# EAGLE design regC_to_HL (EAGLE 9.6.1)
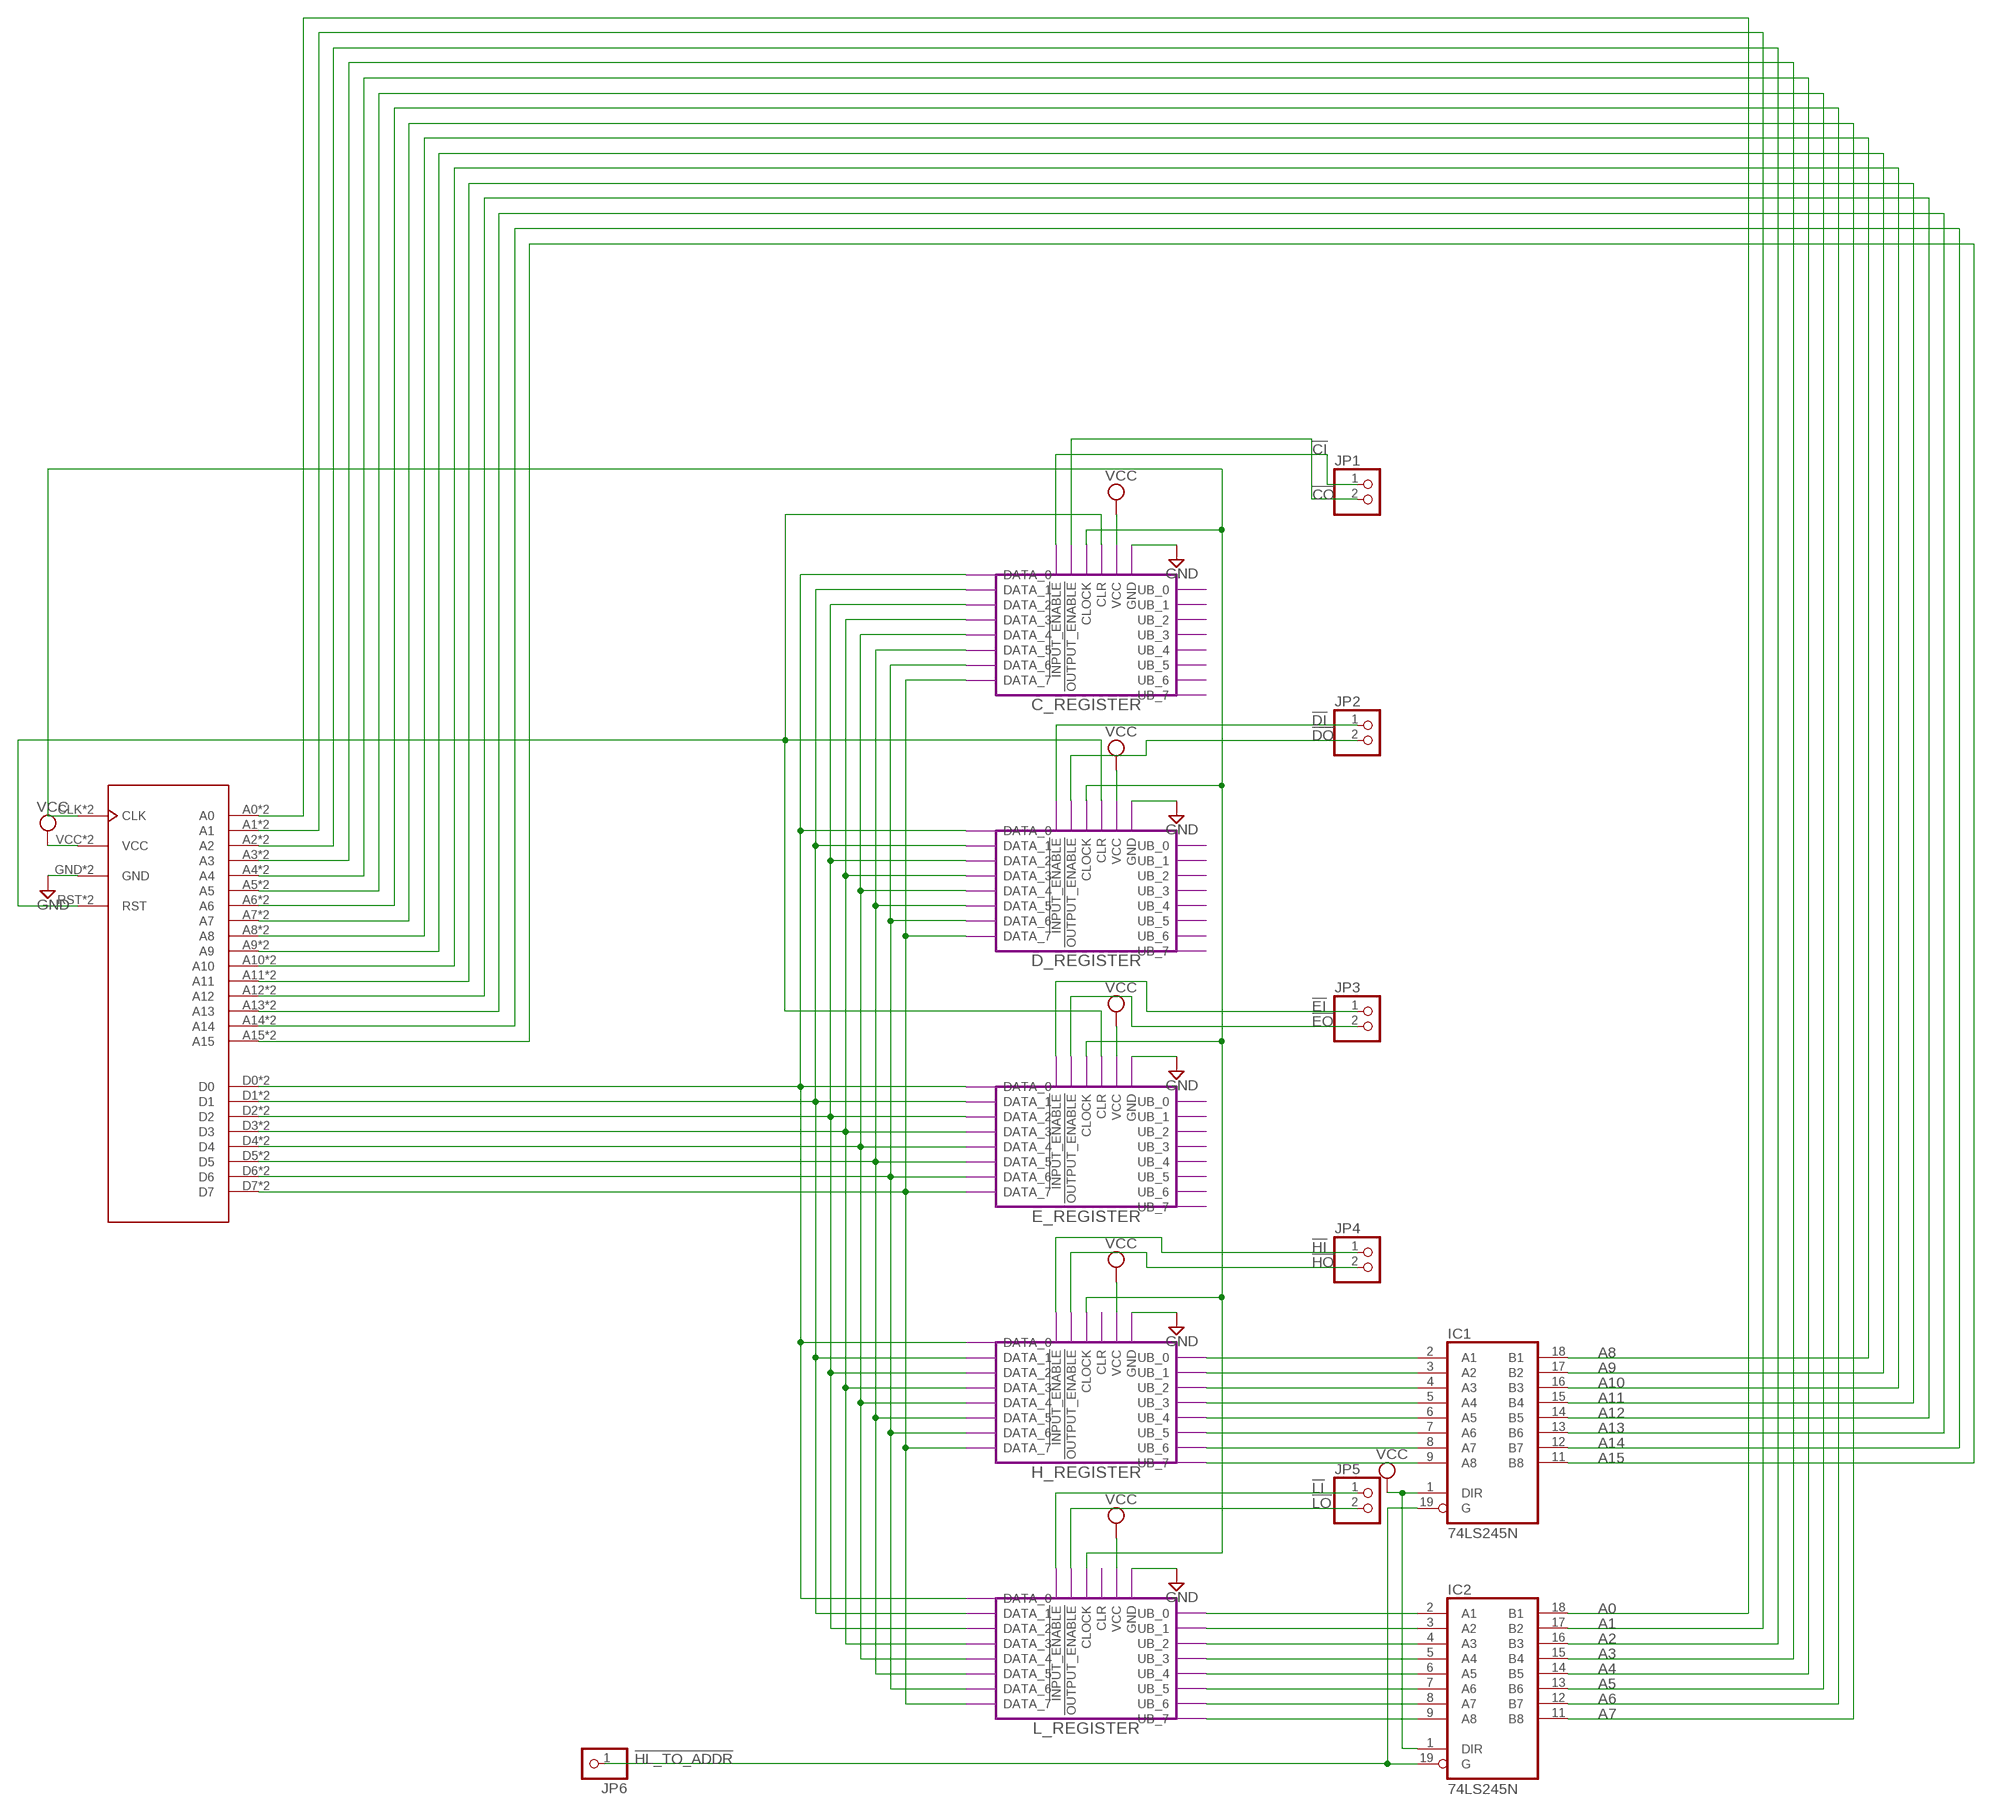
[diagram p0: schematic, sheet 1]

## Parts
IC1  74LS245N  [DIL20]
IC2  74LS245N  [DIL20]
JP1  PINHD-1X2/90  [1X02/90]
JP2  PINHD-1X2/90  [1X02/90]
JP3  PINHD-1X2/90  [1X02/90]
JP4  PINHD-1X2/90  [1X02/90]
JP5  PINHD-1X2/90  [1X02/90]
JP6  PINHD-1X1  [1X01]
U$1  PORT_BOARD  [PORT_FOOTPT]

## Module instances
C_REGISTER = DATA_REGISTOR
D_REGISTER = DATA_REGISTOR
E_REGISTER = DATA_REGISTOR
H_REGISTER = DATA_REGISTOR$A
L_REGISTER = DATA_REGISTOR$A

## Nets
!CI: JP1.1 ; port C_REGISTER.!INPUT_ENABLE
!CO: JP1.2 ; port C_REGISTER.!OUTPUT_ENABLE
!DI: JP2.1 ; port D_REGISTER.!INPUT_ENABLE
!DO: JP2.2 ; port D_REGISTER.!OUTPUT_ENABLE
!EI: JP3.1 ; port E_REGISTER.!INPUT_ENABLE
!EO: JP3.2 ; port E_REGISTER.!OUTPUT_ENABLE
!HI: JP4.1 ; port H_REGISTER.!INPUT_ENABLE
!HL_TO_ADDR: IC1.19(G) IC2.19(G) JP6.1
!HO: JP4.2 ; port H_REGISTER.!OUTPUT_ENABLE
!LI: JP5.1 ; port L_REGISTER.!INPUT_ENABLE
!LO: JP5.2 ; port L_REGISTER.!OUTPUT_ENABLE
A0: IC2.18(B1) U$1.A0 U$1.A16(A0)
A1: IC2.17(B2) U$1.A1 U$1.A17(A1)
A2: IC2.16(B3) U$1.A2 U$1.A18(A2)
A3: IC2.15(B4) U$1.A3 U$1.A19(A3)
A4: IC2.14(B5) U$1.A4 U$1.A20(A4)
A5: IC2.13(B6) U$1.A5 U$1.A21(A5)
A6: IC2.12(B7) U$1.A6 U$1.A22(A6)
A7: IC2.11(B8) U$1.A7 U$1.A23(A7)
A8: IC1.18(B1) U$1.A8 U$1.A24(A8)
A9: IC1.17(B2) U$1.A9 U$1.A25(A9)
A10: IC1.16(B3) U$1.A10 U$1.A26(A10)
A11: IC1.15(B4) U$1.A11 U$1.A27(A11)
A12: IC1.14(B5) U$1.A12 U$1.A28(A12)
A13: IC1.13(B6) U$1.A13 U$1.A29(A13)
A14: IC1.12(B7) U$1.A14 U$1.A30(A14)
A15: IC1.11(B8) U$1.A15 U$1.A31(A15)
CLOCK1: U$1.CLK U$1.CLK1(CLK) ; port L_REGISTER.CLOCK H_REGISTER.CLOCK E_REGISTER.CLOCK D_REGISTER.CLOCK C_REGISTER.CLOCK
DATA_0: U$1.D0 U$1.D8(D0) ; port C_REGISTER.DATA_0 D_REGISTER.DATA_0 E_REGISTER.DATA_0 H_REGISTER.DATA_0 L_REGISTER.DATA_0
DATA_1: U$1.D1 U$1.D9(D1) ; port C_REGISTER.DATA_1 D_REGISTER.DATA_1 E_REGISTER.DATA_1 H_REGISTER.DATA_1 L_REGISTER.DATA_1
DATA_2: U$1.D2 U$1.D10(D2) ; port C_REGISTER.DATA_2 D_REGISTER.DATA_2 E_REGISTER.DATA_2 H_REGISTER.DATA_2 L_REGISTER.DATA_2
DATA_3: U$1.D3 U$1.D11(D3) ; port C_REGISTER.DATA_3 D_REGISTER.DATA_3 E_REGISTER.DATA_3 H_REGISTER.DATA_3 L_REGISTER.DATA_3
DATA_4: U$1.D4 U$1.D12(D4) ; port C_REGISTER.DATA_4 D_REGISTER.DATA_4 E_REGISTER.DATA_4 H_REGISTER.DATA_4 L_REGISTER.DATA_4
DATA_5: U$1.D5 U$1.D13(D5) ; port C_REGISTER.DATA_5 D_REGISTER.DATA_5 E_REGISTER.DATA_5 H_REGISTER.DATA_5 L_REGISTER.DATA_5
DATA_6: U$1.D6 U$1.D14(D6) ; port C_REGISTER.DATA_6 D_REGISTER.DATA_6 E_REGISTER.DATA_6 H_REGISTER.DATA_6 L_REGISTER.DATA_6
DATA_7: U$1.D7 U$1.D15(D7) ; port C_REGISTER.DATA_7 D_REGISTER.DATA_7 E_REGISTER.DATA_7 H_REGISTER.DATA_7 L_REGISTER.DATA_7
GND: U$1.GND U$1.GND1(GND) ; port C_REGISTER.GND D_REGISTER.GND E_REGISTER.GND H_REGISTER.GND L_REGISTER.GND
N$1: U$1.RST U$1.RST1(RST) ; port E_REGISTER.CLR D_REGISTER.CLR C_REGISTER.CLR
N$18: IC1.2(A1) ; port H_REGISTER.UB_0
N$19: IC1.3(A2) ; port H_REGISTER.UB_1
N$20: IC1.4(A3) ; port H_REGISTER.UB_2
N$21: IC1.5(A4) ; port H_REGISTER.UB_3
N$22: IC1.6(A5) ; port H_REGISTER.UB_4
N$23: IC1.7(A6) ; port H_REGISTER.UB_5
N$24: IC1.8(A7) ; port H_REGISTER.UB_6
N$25: IC1.9(A8) ; port H_REGISTER.UB_7
N$26: IC2.2(A1) ; port L_REGISTER.UB_0
N$27: IC2.3(A2) ; port L_REGISTER.UB_1
N$28: IC2.4(A3) ; port L_REGISTER.UB_2
N$29: IC2.5(A4) ; port L_REGISTER.UB_3
N$30: IC2.6(A5) ; port L_REGISTER.UB_4
N$31: IC2.7(A6) ; port L_REGISTER.UB_5
N$32: IC2.8(A7) ; port L_REGISTER.UB_6
N$33: IC2.9(A8) ; port L_REGISTER.UB_7
VCC: IC1.1(DIR) IC2.1(DIR) U$1.VCC U$1.VCC1(VCC) ; port C_REGISTER.VCC D_REGISTER.VCC E_REGISTER.VCC H_REGISTER.VCC L_REGISTER.VCC

## Power pins joined to a net without a drawn wire
GND: IC1.10(GND) IC2.10(GND)
VCC: IC1.20(VCC) IC2.20(VCC)

## Library data of the parts
IC1 IC2 = 74xx-eu:74*245: Octal BUS TRANSCEIVER, 3-state
JP1-JP5 = pinhead:PINHD-1X2: PIN HEADER
JP6 = pinhead:PINHD-1X1: PIN HEADER
U$1 = stack_interface:PORT_BOARD

## Module DATA_REGISTOR
Ports: DATA_0(io) DATA_1(io) DATA_2(io) DATA_3(io) DATA_4(io) DATA_5(io) DATA_6(io) DATA_7(io) !INPUT_ENABLE(in) !OUTPUT_ENABLE(in) CLOCK(in) CLR(in) UB_0(out) UB_1(out) UB_2(out) UB_3(out) UB_4(out) UB_5(out) UB_6(out) UB_7(out) VCC(pwr) GND(pwr)
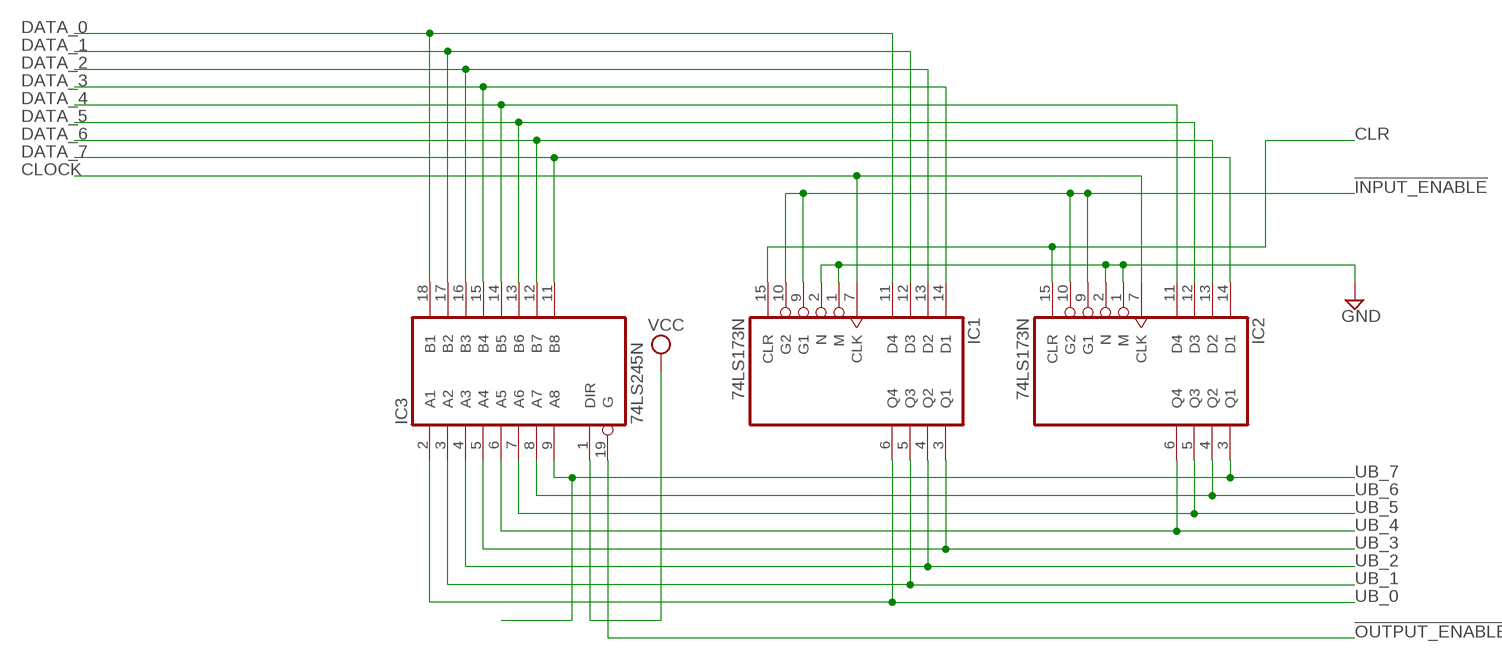
[diagram p1: schematic, module DATA_REGISTOR, sheet 1]

### Parts
IC1  74LS173N  [DIL16]
IC2  74LS173N  [DIL16]
IC3  74LS245N  [DIL20]

### Nets
!INPUT_ENABLE: IC1.9(G1) IC1.10(G2) IC2.9(G1) IC2.10(G2)
!OUTPUT_ENABLE: IC3.19(G)
CLOCK: IC1.7(CLK) IC2.7(CLK)
CLR: IC1.15(CLR) IC2.15(CLR)
DATA_0: IC1.11(D4) IC3.18(B1)
DATA_1: IC1.12(D3) IC3.17(B2)
DATA_2: IC1.13(D2) IC3.16(B3)
DATA_3: IC1.14(D1) IC3.15(B4)
DATA_4: IC2.11(D4) IC3.14(B5)
DATA_5: IC2.12(D3) IC3.13(B6)
DATA_6: IC2.13(D2) IC3.12(B7)
DATA_7: IC2.14(D1) IC3.11(B8)
GND: IC1.1(M) IC1.2(N) IC2.1(M) IC2.2(N)
UB_0: IC1.6(Q4) IC3.2(A1)
UB_1: IC1.5(Q3) IC3.3(A2)
UB_2: IC1.4(Q2) IC3.4(A3)
UB_3: IC1.3(Q1) IC3.5(A4)
UB_4: IC2.6(Q4) IC3.6(A5)
UB_5: IC2.5(Q3) IC3.7(A6)
UB_6: IC2.4(Q2) IC3.8(A7)
UB_7: IC2.3(Q1) IC3.9(A8)
VCC: IC3.1(DIR)

### Power pins joined to a net without a drawn wire
GND: IC1.8(GND) IC2.8(GND) IC3.10(GND)
VCC: IC1.16(VCC) IC2.16(VCC) IC3.20(VCC)

### Library data of the parts
IC1 IC2 = 74xx-eu:74*173: 4-bit D type REGISTER, 3-state
IC3 = 74xx-eu:74*245: Octal BUS TRANSCEIVER, 3-state

## Module DATA_REGISTOR$A
Ports: DATA_0(io) DATA_1(io) DATA_2(io) DATA_3(io) DATA_4(io) DATA_5(io) DATA_6(io) DATA_7(io) !INPUT_ENABLE(in) !OUTPUT_ENABLE(in) CLOCK(in) CLR(in) UB_0(out) UB_1(out) UB_2(out) UB_3(out) UB_4(out) UB_5(out) UB_6(out) UB_7(out) VCC(pwr) GND(pwr)
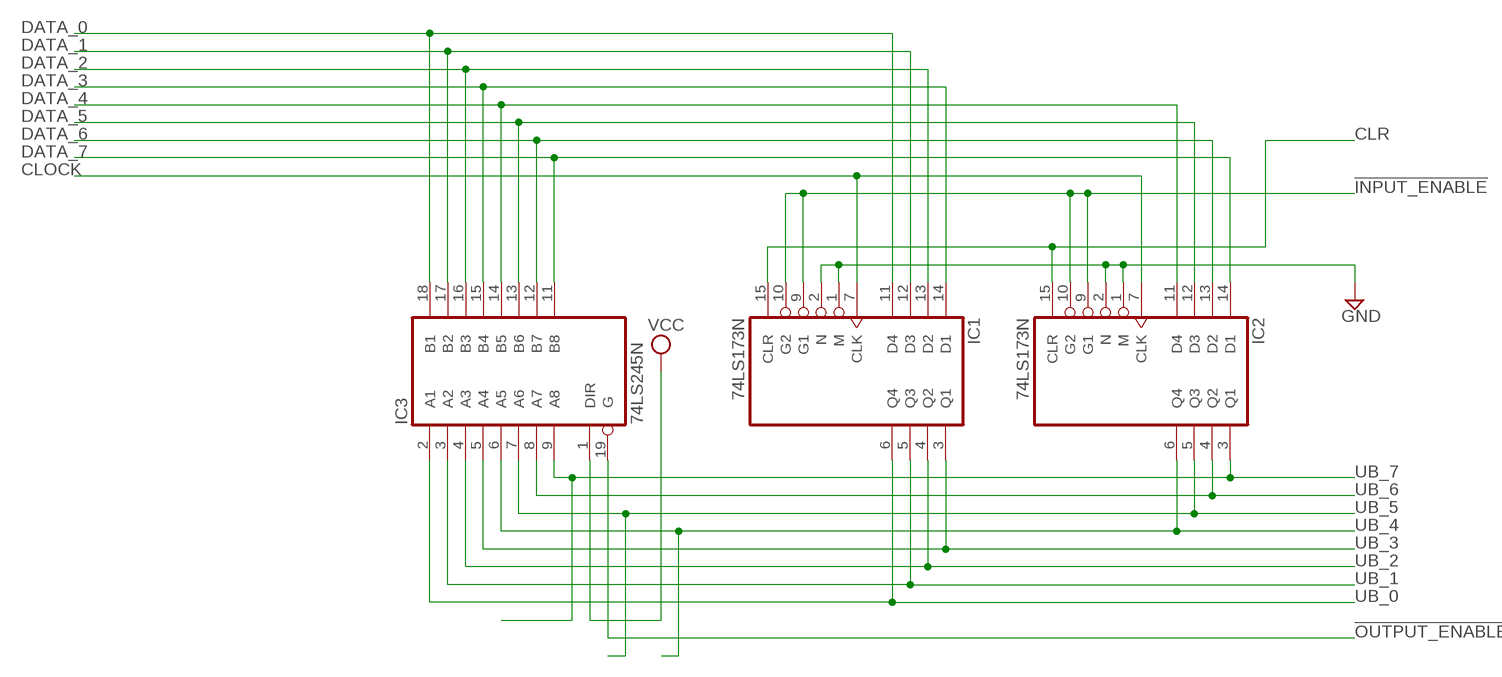
[diagram p2: schematic, module DATA_REGISTOR$A, sheet 1]

### Parts
IC1  74LS173N  [DIL16]
IC2  74LS173N  [DIL16]
IC3  74LS245N  [DIL20]

### Nets
!INPUT_ENABLE: IC1.9(G1) IC1.10(G2) IC2.9(G1) IC2.10(G2)
!OUTPUT_ENABLE: IC3.19(G)
CLOCK: IC1.7(CLK) IC2.7(CLK)
CLR: IC1.15(CLR) IC2.15(CLR)
DATA_0: IC1.11(D4) IC3.18(B1)
DATA_1: IC1.12(D3) IC3.17(B2)
DATA_2: IC1.13(D2) IC3.16(B3)
DATA_3: IC1.14(D1) IC3.15(B4)
DATA_4: IC2.11(D4) IC3.14(B5)
DATA_5: IC2.12(D3) IC3.13(B6)
DATA_6: IC2.13(D2) IC3.12(B7)
DATA_7: IC2.14(D1) IC3.11(B8)
GND: IC1.1(M) IC1.2(N) IC2.1(M) IC2.2(N)
UB_0: IC1.6(Q4) IC3.2(A1)
UB_1: IC1.5(Q3) IC3.3(A2)
UB_2: IC1.4(Q2) IC3.4(A3)
UB_3: IC1.3(Q1) IC3.5(A4)
UB_4: IC2.6(Q4) IC3.6(A5)
UB_5: IC2.5(Q3) IC3.7(A6)
UB_6: IC2.4(Q2) IC3.8(A7)
UB_7: IC2.3(Q1) IC3.9(A8)
VCC: IC3.1(DIR)

### Power pins joined to a net without a drawn wire
GND: IC1.8(GND) IC2.8(GND) IC3.10(GND)
VCC: IC1.16(VCC) IC2.16(VCC) IC3.20(VCC)

### Library data of the parts
IC1 IC2 = 74xx-eu:74*173: 4-bit D type REGISTER, 3-state
IC3 = 74xx-eu:74*245: Octal BUS TRANSCEIVER, 3-state

## Board
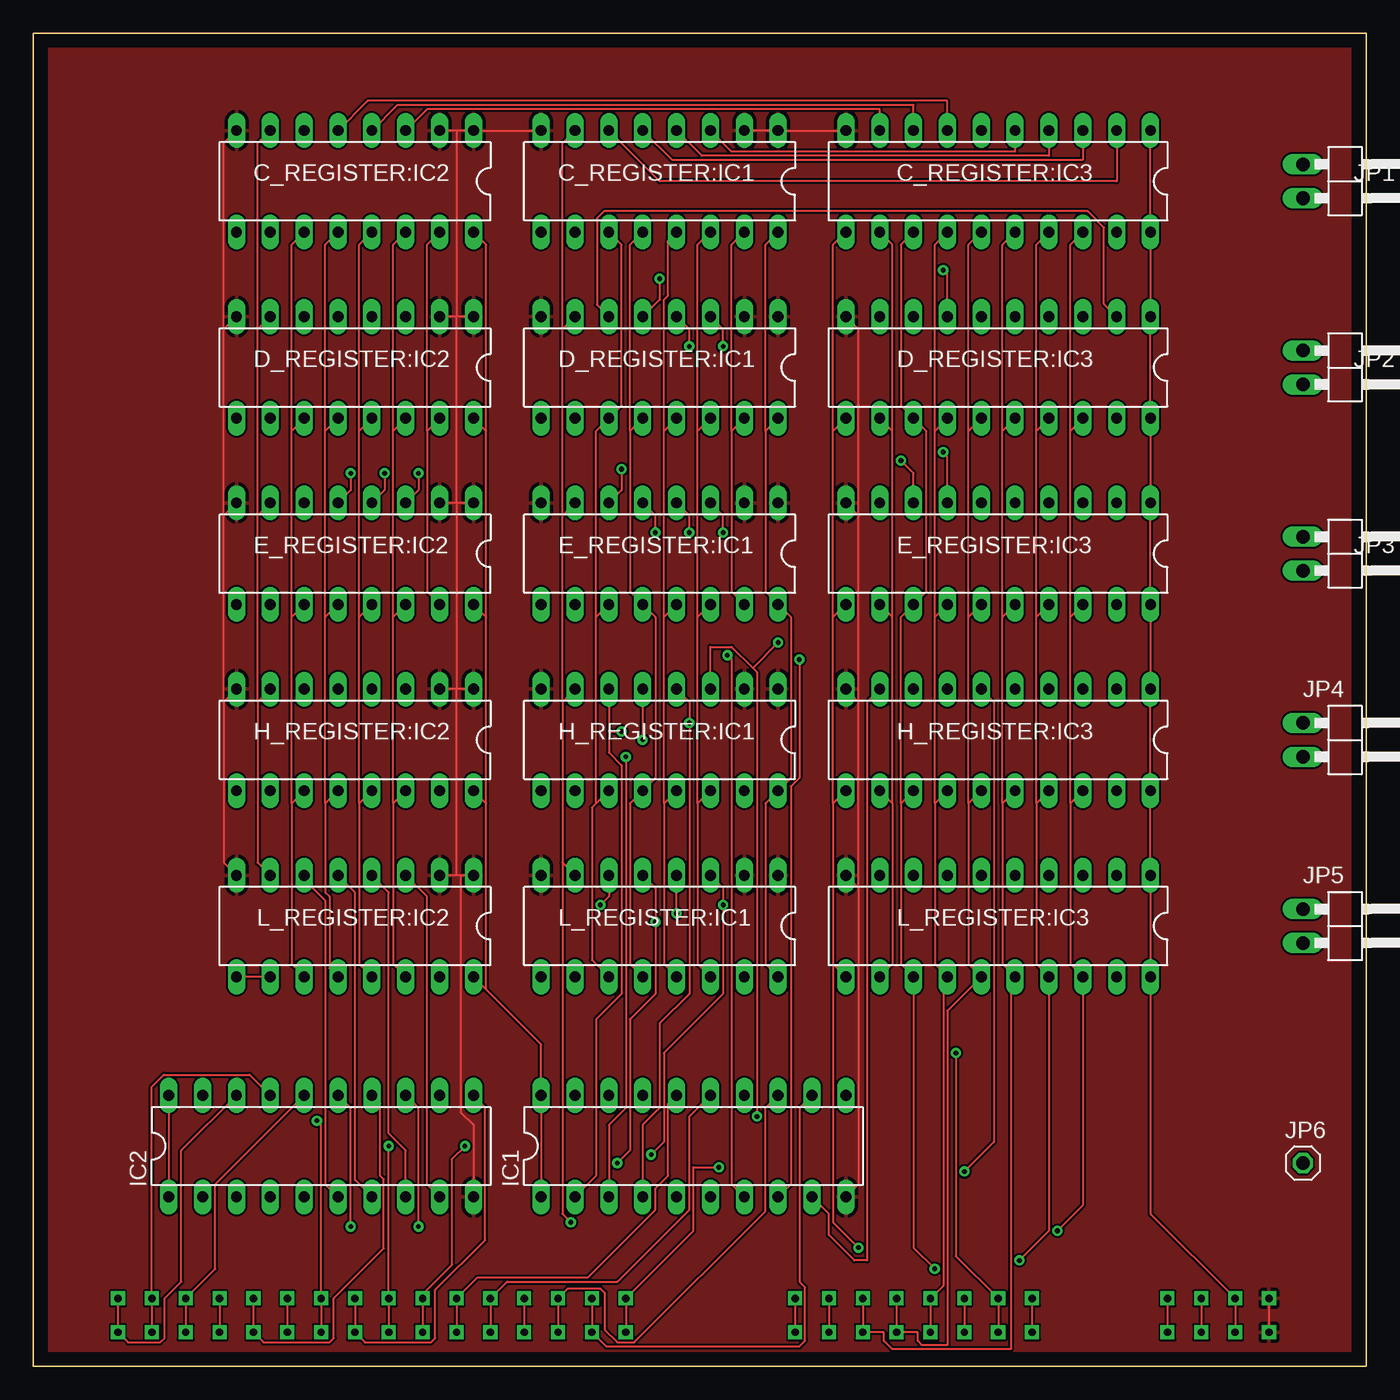
[diagram p3: board, top side]
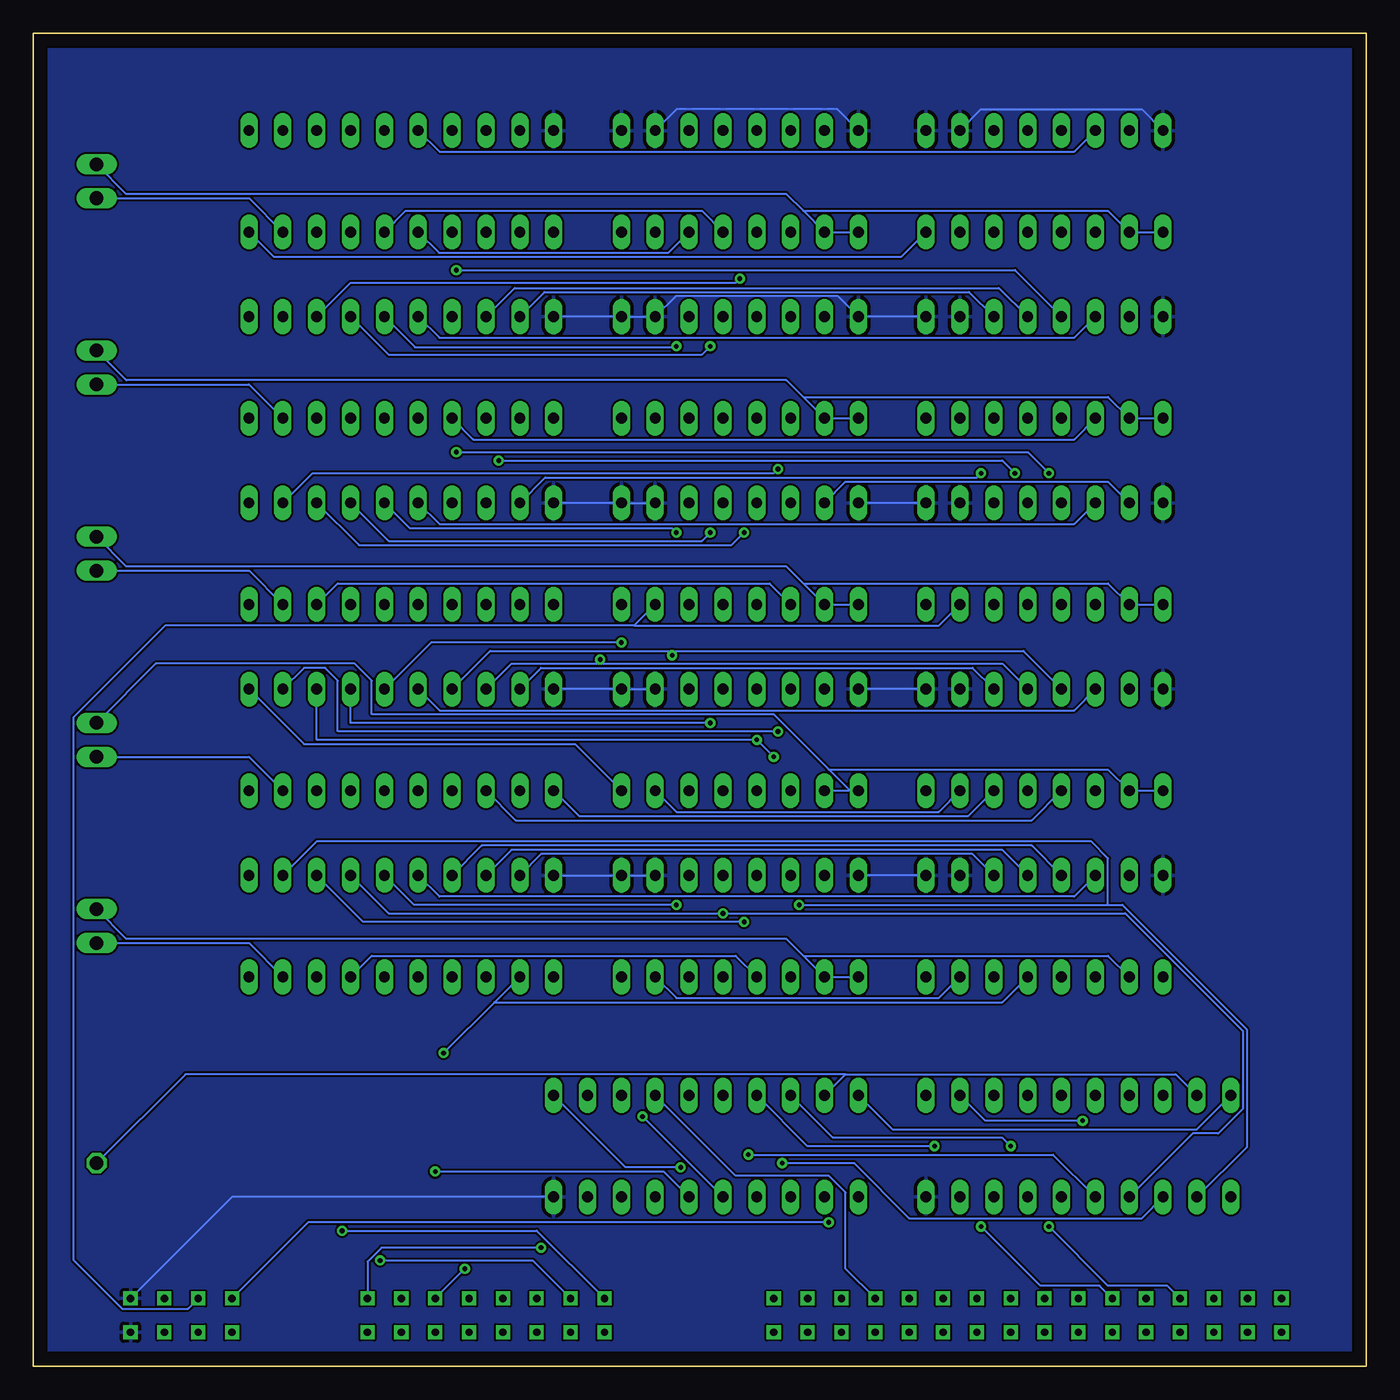
[diagram p4: board, bottom side, seen from below]

Size 100 x 100 mm. Coordinates in mm from the lower left corner, seen from the top.
Copper layers (1*16): Top 0.035mm / dielectric 1.5mm / Bottom 0.035mm
Design rules "default": minimum track width 6mil, minimum drill 0.35mm, track to track 6mil, track to pad 6mil, pad to pad 6mil, via to via 6mil, smd to smd 6mil, copper to edge 40mil, drill to drill 6mil, minimum pad ring 10mil, minimum via ring 8mil, stop-mask expansion 4mil, vias tented up to drill 0mil, thermal gap 10mil

### Footprints (pad centres in the part's own frame; a part is rotated, then mirrored left to right if it is on the bottom)
DIL16 = drill 0.813 long: 1 -8.89,-3.81; 2 -6.35,-3.81; 3 -3.81,-3.81; 4 -1.27,-3.81; 5 1.27,-3.81; 6 3.81,-3.81; 7 6.35,-3.81; 8 8.89,-3.81; 9 8.89,3.81; 10 6.35,3.81; 11 3.81,3.81; 12 1.27,3.81; 13 -1.27,3.81; 14 -3.81,3.81; 15 -6.35,3.81; 16 -8.89,3.81
DIL20 = drill 0.813 long: 1 -11.43,-3.81; 2 -8.89,-3.81; 3 -6.35,-3.81; 4 -3.81,-3.81; 5 -1.27,-3.81; 6 1.27,-3.81; 7 3.81,-3.81; 8 6.35,-3.81; 9 8.89,-3.81; 10 11.43,-3.81; 11 11.43,3.81; 12 8.89,3.81; 13 6.35,3.81; 14 3.81,3.81; 15 1.27,3.81; 16 -1.27,3.81; 17 -3.81,3.81; 18 -6.35,3.81; 19 -8.89,3.81; 20 -11.43,3.81
1X02/90 = drill 1.016 long: 1 -1.27,-3.81; 2 1.27,-3.81
1X01 = drill 1.016 octagon: 1 0,0
PORT_FOOTPT = drill 0.55 square: A0 6.35,2.54; A1 8.89,2.54; A2 11.43,2.54; A3 13.97,2.54; A4 16.51,2.54; A5 19.05,2.54; A6 21.59,2.54; A7 24.13,2.54; A8 26.67,2.54; A9 29.21,2.54; A10 31.75,2.54; A11 34.29,2.54; A12 36.83,2.54; A13 39.37,2.54; A14 41.91,2.54; A15 44.45,2.54; A16 6.35,5.08; A17 8.89,5.08; A18 11.43,5.08; A19 13.97,5.08; A20 16.51,5.08; A21 19.05,5.08; A22 21.59,5.08; A23 24.13,5.08; A24 26.67,5.08; A25 29.21,5.08; A26 31.75,5.08; A27 34.29,5.08; A28 36.83,5.08; A29 39.37,5.08; A30 41.91,5.08; A31 44.45,5.08; CLK 85.09,2.54; CLK1 85.09,5.08; D0 57.15,2.54; D1 59.69,2.54; D2 62.23,2.54; D3 64.77,2.54; D4 67.31,2.54; D5 69.85,2.54; D6 72.39,2.54; D7 74.93,2.54; D8 57.15,5.08; D9 59.69,5.08; D10 62.23,5.08; D11 64.77,5.08; D12 67.31,5.08; D13 69.85,5.08; D14 72.39,5.08; D15 74.93,5.08; GND 92.71,2.54; GND1 92.71,5.08; RST 87.63,2.54; RST1 87.63,5.08; VCC 90.17,2.54; VCC1 90.17,5.08

### Placement (x,y rotation side)
C_REGISTER:IC1  74LS173N  [DIL16]  46.99,88.9 180 top
C_REGISTER:IC2  74LS173N  [DIL16]  24.13,88.9 180 top
C_REGISTER:IC3  74LS245N  [DIL20]  72.39,88.9 180 top
D_REGISTER:IC1  74LS173N  [DIL16]  46.99,74.93 180 top
D_REGISTER:IC2  74LS173N  [DIL16]  24.13,74.93 180 top
D_REGISTER:IC3  74LS245N  [DIL20]  72.39,74.93 180 top
E_REGISTER:IC1  74LS173N  [DIL16]  46.99,60.96 180 top
E_REGISTER:IC2  74LS173N  [DIL16]  24.13,60.96 180 top
E_REGISTER:IC3  74LS245N  [DIL20]  72.39,60.96 180 top
H_REGISTER:IC1  74LS173N  [DIL16]  46.99,46.99 180 top
H_REGISTER:IC2  74LS173N  [DIL16]  24.13,46.99 180 top
H_REGISTER:IC3  74LS245N  [DIL20]  72.39,46.99 180 top
IC1  49.53,16.51 0 top
IC2  21.59,16.51 0 top
JP1  99.06,88.9 270 top
JP2  99.06,74.93 270 top
JP3  99.06,60.96 270 top
JP4  99.06,46.99 270 top
JP5  99.06,33.02 270 top
JP6  95.25,15.24 0 top
L_REGISTER:IC1  74LS173N  [DIL16]  46.99,33.02 180 top
L_REGISTER:IC2  74LS173N  [DIL16]  24.13,33.02 180 top
L_REGISTER:IC3  74LS245N  [DIL20]  72.39,33.02 180 top
U$1  0,0 0 top

### Tracks (layer width: path | path; a pad name or v marks a point on that pad's centre or on a via)
!CI
  Bottom 0.152: C_REGISTER:IC2.9 C_REGISTER:IC2.10 19.37,86.68 42.23,86.68 | C_REGISTER:IC1.9 C_REGISTER:IC1.10 42.23,86.68 | JP1.1 93.03,87.95 43.5,87.95 42.23,86.68
!CO
  Bottom 0.152: C_REGISTER:IC3.19 83.82,87.63 JP1.2
!DI
  Bottom 0.152: D_REGISTER:IC2.9 D_REGISTER:IC2.10 19.37,72.71 42.23,72.71 | D_REGISTER:IC1.9 D_REGISTER:IC1.10 42.23,72.71 | JP2.1 93.03,73.98 43.5,73.98 42.23,72.71
!DO
  Bottom 0.152: D_REGISTER:IC3.19 83.82,73.66 JP2.2
!EI
  Bottom 0.152: E_REGISTER:IC2.9 E_REGISTER:IC2.10 19.37,58.74 42.23,58.74 | E_REGISTER:IC1.9 E_REGISTER:IC1.10 42.23,58.74 | JP3.1 93.03,60.01 43.5,60.01 42.23,58.74
!EO
  Bottom 0.152: E_REGISTER:IC3.19 83.82,59.69 JP3.2
!HI
  Bottom 0.152: H_REGISTER:IC2.9 H_REGISTER:IC2.10 19.37,44.77 40.32,44.77 | H_REGISTER:IC1.10 38.73,43.18 | JP4.1 90.81,52.7 75.88,52.7 74.61,51.43 74.61,48.89 44.45,48.89 40.32,44.77 | 38.73,43.18 40.32,44.77 | 38.73,43.18 H_REGISTER:IC1.9
!HL_TO_ADDR
  Bottom 0.152: IC2.19 14.29,21.91 39.05,21.91 | IC1.19 39.05,21.91 | JP6.1 88.58,21.91 39.05,21.91
!HO
  Bottom 0.152: H_REGISTER:IC3.19 83.82,45.72 JP4.2
!LI
  Top 0.152: L_REGISTER:IC2.10 L_REGISTER:IC2.9
  Bottom 0.152: L_REGISTER:IC1.9 L_REGISTER:IC1.10 42.23,30.8 | JP5.1 93.03,32.07 43.5,32.07 42.23,30.8 | L_REGISTER:IC2.10 19.37,30.8 42.23,30.8
!LO
  Bottom 0.152: L_REGISTER:IC3.19 83.82,31.75 JP5.2
A0
  Top 0.152: U$1.A16 U$1.A0 7.11,1.78 9.51,1.78 9.84,2.11 9.84,5.08 11.11,6.35 11.11,16.19 IC2.18
A1
  Top 0.152: U$1.A1 U$1.A17 8.89,20.97 9.79,21.87 16.23,21.87 IC2.17
A2
  Top 0.152: U$1.A2 U$1.A18 13.65,7.3 13.65,13.65 IC2.16
A3  (via drill 0.35)
  Top 0.152: U$1.A19 U$1.A3 | IC2.15 23.81,19.37 v23.81,10.48
  Bottom 0.152: v23.81,10.48 19.37,6.03 14.92,6.03 U$1.A19
A4
  Top 0.152: U$1.A20 U$1.A4 17.27,1.78 22.21,1.78 22.54,2.11 22.54,5.08 26.29,8.83 26.29,14.03 26.03,14.29 26.03,19.68 IC2.14
A5  (via drill 0.35)
  Top 0.152: U$1.A21 U$1.A5 | IC2.13 28.89,19.37 v28.89,10.48
  Bottom 0.152: v28.89,10.48 24.45,6.03 20,6.03 U$1.A21
A6  (via drill 0.35)
  Top 0.152: U$1.A6 U$1.A22 21.59,18.1 v21.27,18.41
  Bottom 0.152: IC2.12 28.58,18.41 v21.27,18.41
A7
  Top 0.152: U$1.A23 U$1.A7 24.89,1.78 29.83,1.78 30.16,2.11 30.16,5.71 33.91,9.46 33.91,19.43 IC2.11
A8  (via drill 0.35)
  Top 0.152: U$1.A8 U$1.A24 v26.67,16.51
  Bottom 0.152: IC1.18 40,17.14 27.31,17.14 v26.67,16.51
A9  (via drill 0.35)
  Top 0.152: U$1.A9 U$1.A25 29.21,5.4 31.43,7.62 31.43,15.56 v32.39,16.51
  Bottom 0.152: IC1.17 41.91,16.51 v32.39,16.51
A10
  Top 0.152: U$1.A10 U$1.A26 33.34,6.67 41.61,6.67 46.67,11.74 46.67,13.34 47.62,14.29 47.62,19.68 IC1.16
A11
  Top 0.152: U$1.A11 U$1.A27 35.56,6.35 43.83,6.35 49.21,11.74 49.21,18.73 IC1.15
A12
  Top 0.152: U$1.A28 U$1.A12
  Bottom 0.152: IC1.14 47.31,14.29 40.31,14.29 39.05,13.03 39.05,7.3 U$1.A28
A13
  Top 0.152: U$1.A13 U$1.A29 40.13,5.84 42.53,5.84 42.86,5.51 42.86,2.75 43.83,1.78 45.07,1.78 54.93,11.64 54.93,19.37 IC1.13
A14
  Top 0.152: U$1.A30 U$1.A14 42.97,1.48 57.47,1.48 57.91,1.92 57.91,5.91 57.53,6.29 57.53,19.43 IC1.12
A15  (via drill 0.35)
  Top 0.152: U$1.A15 U$1.A31 49.53,10.16 49.53,14.92 v51.44,14.92
  Bottom 0.152: IC1.11 55.56,14.92 v51.44,14.92
C_REGISTER:UB_0
  Top 0.152: C_REGISTER:IC1.6 46.99,88.9 81.28,88.9 C_REGISTER:IC3.2
C_REGISTER:UB_1
  Top 0.152: C_REGISTER:IC1.5 47.94,90.49 78.74,90.49 C_REGISTER:IC3.3
C_REGISTER:UB_2
  Top 0.152: C_REGISTER:IC1.4 50.16,90.81 76.2,90.81 C_REGISTER:IC3.4
C_REGISTER:UB_3
  Top 0.152: C_REGISTER:IC1.3 52.39,91.12 73.66,91.12 C_REGISTER:IC3.5
C_REGISTER:UB_4
  Bottom 0.152: C_REGISTER:IC2.6 21.91,91.12 69.53,91.12 C_REGISTER:IC3.6
C_REGISTER:UB_5
  Top 0.152: C_REGISTER:IC2.5 25.08,94.93 68.58,94.93 C_REGISTER:IC3.7
C_REGISTER:UB_6
  Top 0.152: C_REGISTER:IC2.4 27.31,94.62 66.04,94.62 C_REGISTER:IC3.8
C_REGISTER:UB_7
  Top 0.152: C_REGISTER:IC2.3 29.53,94.3 63.5,94.3 C_REGISTER:IC3.9
CLOCK1  (via drill 0.35)
  Top 0.152: L_REGISTER:IC2.7 16.83,37.78 16.83,49.85 | H_REGISTER:IC2.7 16.83,49.85 | 16.83,63.82 E_REGISTER:IC2.7 | 16.83,49.85 16.83,63.82 | 16.83,77.79 D_REGISTER:IC2.7 | 16.83,63.82 16.83,77.79 | C_REGISTER:IC2.7 16.83,91.76 16.83,77.79 | U$1.CLK1 U$1.CLK | 39.69,37.78 L_REGISTER:IC1.7 | 39.69,49.85 39.69,37.78 | H_REGISTER:IC1.7 39.69,49.85 | 39.69,63.82 E_REGISTER:IC1.7 | 39.69,49.85 39.69,63.82 | 39.69,77.79 D_REGISTER:IC1.7 | 39.69,63.82 39.69,77.79 | C_REGISTER:IC1.7 39.69,91.76 39.69,77.79 | v40.32,10.79 39.69,11.43 39.69,37.78
  Bottom 0.152: U$1.CLK1 79.38,10.79 v40.32,10.79 | E_REGISTER:IC2.7 19.37,66.36 39.05,66.36 E_REGISTER:IC1.7
D_REGISTER:UB_0
  Top 0.152: D_REGISTER:IC3.2 80.33,79.69 80.33,85.42 79.11,86.64 42.81,86.64 42.29,86.12 42.29,79.63 D_REGISTER:IC1.6
D_REGISTER:UB_1  (via drill 0.35)
  Top 0.152: D_REGISTER:IC1.5 46.99,80.01 v46.99,81.6
  Bottom 0.152: v46.99,81.6 47.31,81.28 76.2,81.28 D_REGISTER:IC3.3
D_REGISTER:UB_2  (via drill 0.35)
  Top 0.152: D_REGISTER:IC1.4 49.21,77.79 v49.21,76.52
  Bottom 0.152: v49.21,76.52 49.85,75.88 73.34,75.88 D_REGISTER:IC3.4
D_REGISTER:UB_3  (via drill 0.35)
  Top 0.152: D_REGISTER:IC1.3 51.75,77.79 v51.75,76.52
  Bottom 0.152: v51.75,76.52 51.82,76.45 71.37,76.45 D_REGISTER:IC3.5
D_REGISTER:UB_4
  Bottom 0.152: D_REGISTER:IC2.6 21.91,77.15 69.53,77.15 D_REGISTER:IC3.6
D_REGISTER:UB_5  (via drill 0.35)
  Top 0.152: v68.26,82.23 68.58,81.92 D_REGISTER:IC3.7
  Bottom 0.152: D_REGISTER:IC2.5 26.35,82.23 v68.26,82.23
D_REGISTER:UB_6
  Bottom 0.152: D_REGISTER:IC3.8 63.88,80.9 27.56,80.9 D_REGISTER:IC2.4
D_REGISTER:UB_7
  Bottom 0.152: D_REGISTER:IC3.9 61.65,80.59 29.79,80.59 D_REGISTER:IC2.3
DATA_0  (via drill 0.35)
  Top 0.152: L_REGISTER:IC1.11 41.91,30.48 41.91,41.91 42.23,42.23 | H_REGISTER:IC1.11 42.23,42.23 | 42.23,56.2 E_REGISTER:IC1.11 | 42.23,42.23 42.23,56.2 | 42.23,56.2 42.23,70.17 D_REGISTER:IC1.11 44.13,72.07 44.13,84.14 C_REGISTER:IC1.11 | U$1.D8 U$1.D0 | 77.79,42.23 77.79,30.16 L_REGISTER:IC3.18 78.74,12.07 v76.84,10.16 | H_REGISTER:IC3.18 77.79,42.23 | 77.79,56.2 E_REGISTER:IC3.18 | 77.79,42.23 77.79,56.2 | 77.79,70.17 D_REGISTER:IC3.18 | 77.79,56.2 77.79,70.17 | C_REGISTER:IC3.18 77.79,84.14 77.79,70.17
  Bottom 0.152: U$1.D8 62.23,10.16 v76.84,10.16 | E_REGISTER:IC1.11 44.77,58.74 77.15,58.74 E_REGISTER:IC3.18
DATA_1  (via drill 0.35)
  Top 0.152: L_REGISTER:IC1.12 44.77,30.16 44.77,42.23 H_REGISTER:IC1.12 46.67,44.13 46.67,56.2 E_REGISTER:IC1.12 44.77,58.1 44.77,70.17 | D_REGISTER:IC1.12 44.77,70.17 | C_REGISTER:IC1.12 44.77,84.14 44.77,70.17 | U$1.D9 U$1.D1 | 75.25,42.23 75.25,30.16 L_REGISTER:IC3.17 76.2,10.16 v73.98,7.94 | H_REGISTER:IC3.17 75.25,42.23 | 75.25,56.2 E_REGISTER:IC3.17 | 75.25,42.23 75.25,56.2 | 75.25,70.17 D_REGISTER:IC3.17 | 75.25,56.2 75.25,70.17 | C_REGISTER:IC3.17 75.25,84.14 75.25,70.17
  Bottom 0.152: U$1.D9 62.55,7.94 v73.98,7.94 | L_REGISTER:IC1.12 47.31,30.8 74.61,30.8 L_REGISTER:IC3.17
DATA_2
  Top 0.152: L_REGISTER:IC1.13 47.31,30.16 47.31,42.23 | H_REGISTER:IC1.13 47.31,42.23 | 47.31,56.2 E_REGISTER:IC1.13 | 47.31,42.23 47.31,56.2 | 47.31,70.17 D_REGISTER:IC1.13 | 47.31,56.2 47.31,70.17 | C_REGISTER:IC1.13 47.62,84.45 47.62,80.33 47.31,80.01 47.31,70.17 | U$1.D10 U$1.D2 63.82,2.54 63.82,1.9 64.45,1.27 73.34,1.27 73.34,29.53 | 73.34,29.53 72.71,30.16 72.71,42.23 | H_REGISTER:IC3.16 72.71,42.23 | 72.71,56.2 E_REGISTER:IC3.16 | 72.71,42.23 72.71,56.2 | 72.71,70.17 D_REGISTER:IC3.16 | 72.71,56.2 72.71,70.17 | C_REGISTER:IC3.16 72.71,84.14 72.71,70.17 | 73.34,29.53 L_REGISTER:IC3.16
  Bottom 0.152: C_REGISTER:IC1.13 49.85,86.68 72.07,86.68 C_REGISTER:IC3.16
DATA_3
  Top 0.152: L_REGISTER:IC1.14 49.85,30.16 49.85,42.23 | H_REGISTER:IC1.14 49.85,42.23 | 49.85,56.2 E_REGISTER:IC1.14 | 49.85,42.23 49.85,56.2 | 49.85,70.17 D_REGISTER:IC1.14 | 49.85,56.2 49.85,70.17 | C_REGISTER:IC1.14 49.85,84.14 49.85,70.17 | U$1.D11 U$1.D3 66.36,2.54 66.36,1.9 66.68,1.59 68.58,1.59 68.58,26.67 L_REGISTER:IC3.15 70.17,30.16 70.17,42.23 | H_REGISTER:IC3.15 70.17,42.23 | 70.17,56.2 E_REGISTER:IC3.15 | 70.17,42.23 70.17,56.2 | 70.17,70.17 D_REGISTER:IC3.15 | 70.17,56.2 70.17,70.17 | C_REGISTER:IC3.15 70.17,84.14 70.17,70.17
  Bottom 0.152: C_REGISTER:IC3.15 69.57,83.54 52.35,83.54 C_REGISTER:IC1.14
DATA_4
  Top 0.152: L_REGISTER:IC2.11 19.37,30.16 19.37,42.23 | H_REGISTER:IC2.11 19.37,42.23 | 19.37,56.2 E_REGISTER:IC2.11 | 19.37,42.23 19.37,56.2 | 19.37,70.17 D_REGISTER:IC2.11 | 19.37,56.2 19.37,70.17 | C_REGISTER:IC2.11 19.37,84.14 19.37,70.17 | U$1.D4 U$1.D12 68.26,6.03 68.26,29.53 | 68.26,29.53 67.63,30.16 67.63,42.23 | H_REGISTER:IC3.14 67.63,42.23 | 67.63,56.2 E_REGISTER:IC3.14 | 67.63,42.23 67.63,56.2 | 67.63,70.17 D_REGISTER:IC3.14 | 67.63,56.2 67.63,70.17 | C_REGISTER:IC3.14 67.63,84.14 67.63,70.17 | 68.26,29.53 L_REGISTER:IC3.14
  Bottom 0.152: D_REGISTER:IC2.11 21.91,69.53 66.99,69.53 D_REGISTER:IC3.14
DATA_5  (via drill 0.35)
  Top 0.152: L_REGISTER:IC2.12 22.22,29.84 22.22,35.24 21.91,35.56 21.91,42.23 | H_REGISTER:IC2.12 21.91,42.23 | 21.91,56.2 E_REGISTER:IC2.12 | 21.91,42.23 21.91,56.2 | 21.91,70.17 D_REGISTER:IC2.12 | 21.91,56.2 21.91,70.17 | C_REGISTER:IC2.12 21.91,84.14 21.91,70.17 | C_REGISTER:IC3.13 65.09,84.14 65.09,72.07 D_REGISTER:IC3.13 66.99,70.17 66.99,58.1 E_REGISTER:IC3.13 65.09,56.2 65.09,42.23 | U$1.D13 U$1.D5 | 65.09,42.23 65.09,30.16 L_REGISTER:IC3.13 66.04,8.89 v67.63,7.3 | H_REGISTER:IC3.13 65.09,42.23
  Bottom 0.152: v67.63,7.3 U$1.D13 | H_REGISTER:IC2.12 25.08,40.96 63.82,40.96 H_REGISTER:IC3.13
DATA_6  (via drill 0.35)
  Top 0.152: L_REGISTER:IC2.13 24.45,30.16 24.45,42.23 | H_REGISTER:IC2.13 24.45,42.23 | 24.45,56.2 E_REGISTER:IC2.13 | 24.45,42.23 24.45,56.2 | 24.45,70.17 D_REGISTER:IC2.13 | 24.45,56.2 24.45,70.17 | C_REGISTER:IC2.13 24.45,84.14 24.45,70.17 | U$1.D6 U$1.D14 69.22,8.26 v69.22,23.5 | L_REGISTER:IC3.12 64.45,30.16 64.45,42.23 | H_REGISTER:IC3.12 64.45,42.23 | 64.45,56.2 E_REGISTER:IC3.12 | 64.45,42.23 64.45,56.2 | 64.45,70.17 D_REGISTER:IC3.12 | 64.45,56.2 64.45,70.17 | C_REGISTER:IC3.12 64.45,84.14 64.45,70.17
  Bottom 0.152: L_REGISTER:IC3.12 65.41,27.3 | 65.41,27.3 v69.22,23.5 | L_REGISTER:IC2.13 27.31,27.3 65.41,27.3
DATA_7  (via drill 0.35)
  Top 0.152: L_REGISTER:IC2.14 26.99,30.16 26.99,42.23 | H_REGISTER:IC2.14 26.99,42.23 | 26.99,56.2 E_REGISTER:IC2.14 | 26.99,42.23 26.99,56.2 | 26.99,70.17 D_REGISTER:IC2.14 | 26.99,56.2 26.99,70.17 | C_REGISTER:IC2.14 26.99,84.14 26.99,70.17 | U$1.D15 U$1.D7 | 60.01,30.16 L_REGISTER:IC3.11 | 60.01,42.23 60.01,30.16 | H_REGISTER:IC3.11 60.01,42.23 | 60.01,56.2 E_REGISTER:IC3.11 | 60.01,42.23 60.01,56.2 | 60.01,70.17 D_REGISTER:IC3.11 | 60.01,56.2 60.01,70.17 | C_REGISTER:IC3.11 60.01,84.14 60.01,70.17 | v61.91,8.89 60.01,10.79 60.01,30.16
  Bottom 0.152: H_REGISTER:IC2.14 29.84,41.27 59.05,41.27 H_REGISTER:IC3.11 | v61.91,8.89 73.88,8.89 74.93,7.84 U$1.D15
E_REGISTER:UB_0  (via drill 0.35)
  Top 0.152: E_REGISTER:IC1.6 44.13,65.72 v44.13,67.31
  Bottom 0.152: v44.13,67.31 44.45,66.99 79.06,66.99 E_REGISTER:IC3.2
E_REGISTER:UB_1  (via drill 0.35)
  Top 0.152: E_REGISTER:IC1.5 46.67,63.82 v46.67,62.55
  Bottom 0.152: v46.67,62.55 47.62,61.59 75.56,61.59 E_REGISTER:IC3.3
E_REGISTER:UB_2  (via drill 0.35)
  Top 0.152: E_REGISTER:IC1.4 49.21,63.82 v49.21,62.55
  Bottom 0.152: v49.21,62.55 49.85,61.91 73.34,61.91 E_REGISTER:IC3.4
E_REGISTER:UB_3  (via drill 0.35)
  Top 0.152: E_REGISTER:IC1.3 51.75,63.82 v51.75,62.55
  Bottom 0.152: v51.75,62.55 52.07,62.87 71.75,62.87 E_REGISTER:IC3.5
E_REGISTER:UB_4
  Bottom 0.152: E_REGISTER:IC2.6 21.91,63.18 69.53,63.18 E_REGISTER:IC3.6
E_REGISTER:UB_5  (via drill 0.35)
  Top 0.152: E_REGISTER:IC2.5 23.81,65.72 v23.81,66.99 | v68.26,68.58 68.58,68.26 E_REGISTER:IC3.7
  Bottom 0.152: v23.81,66.99 25.4,68.58 v68.26,68.58
E_REGISTER:UB_6  (via drill 0.35)
  Top 0.152: E_REGISTER:IC2.4 26.35,65.72 v26.35,66.99 | v65.09,67.95 66.04,66.99 E_REGISTER:IC3.8
  Bottom 0.152: v26.35,66.99 27.31,67.95 v65.09,67.95
E_REGISTER:UB_7  (via drill 0.35)
  Top 0.152: E_REGISTER:IC2.3 28.89,65.72 v28.89,66.99
  Bottom 0.152: v28.89,66.99 29.21,66.67 61.59,66.67 E_REGISTER:IC3.9
GND
  Top 0.152: U$1.GND1 U$1.GND | IC1.10 61.91,13.65 61.91,35.88 | L_REGISTER:IC3.10 61.91,35.88 | 61.91,49.85 H_REGISTER:IC3.10 | 61.91,35.88 61.91,49.85 | 61.91,63.82 E_REGISTER:IC3.10 | 61.91,49.85 61.91,63.82 | D_REGISTER:IC3.10 61.91,77.79 61.91,63.82 | L_REGISTER:IC2.8 14.29,37.78 14.29,49.85 | H_REGISTER:IC2.8 14.29,49.85 | 14.29,63.82 E_REGISTER:IC2.8 | 14.29,49.85 14.29,63.82 | 14.29,77.79 D_REGISTER:IC2.8 | 14.29,63.82 14.29,77.79 | C_REGISTER:IC2.8 14.29,91.76 14.29,77.79 | C_REGISTER:IC1.2 C_REGISTER:IC1.1 C_REGISTER:IC3.10 | D_REGISTER:IC2.1 31.75,78.74 | 31.75,78.74 D_REGISTER:IC2.2 | 31.75,92.71 C_REGISTER:IC2.1 C_REGISTER:IC1.8 | 31.75,92.71 C_REGISTER:IC2.2 | 31.75,92.71 31.75,78.74 | H_REGISTER:IC2.1 31.75,50.8 | 31.75,50.8 H_REGISTER:IC2.2 | E_REGISTER:IC2.1 31.75,64.77 | 31.75,64.77 E_REGISTER:IC2.2 | 31.75,64.77 31.75,50.8 | L_REGISTER:IC2.1 32.07,36.83 | 32.07,36.83 31.75,36.83 | 31.75,36.83 L_REGISTER:IC2.2 | IC2.10 33.02,18.1 32.07,19.05 32.07,36.83 | 31.75,36.83 31.75,50.8 | 31.75,64.77 31.75,78.74
  Bottom 0.152: D_REGISTER:IC3.10 D_REGISTER:IC1.1 D_REGISTER:IC1.2 51.79,80.29 39.65,80.29 D_REGISTER:IC1.8 D_REGISTER:IC2.1 | E_REGISTER:IC1.2 E_REGISTER:IC1.1 E_REGISTER:IC3.10 | H_REGISTER:IC1.2 H_REGISTER:IC1.1 H_REGISTER:IC3.10 | L_REGISTER:IC1.2 L_REGISTER:IC1.1 L_REGISTER:IC3.10 | U$1.GND1 85.09,12.7 IC1.10 | C_REGISTER:IC1.2 51.75,94.3 39.69,94.3 C_REGISTER:IC1.8 | H_REGISTER:IC2.1 H_REGISTER:IC1.8 | E_REGISTER:IC2.1 E_REGISTER:IC1.8 | L_REGISTER:IC2.1 L_REGISTER:IC1.8 | C_REGISTER:IC2.8 16.83,94.3 28.89,94.3 C_REGISTER:IC2.2
  pour Top: 0,0 99.82,0 99.82,100.2 0,100.2
  pour Bottom: 0,0 99.95,0 99.95,100.2 0,100.2
H_REGISTER:CLR
  Bottom 0.152: H_REGISTER:IC2.15 32.07,41.59 51.75,41.59 H_REGISTER:IC1.15
L_REGISTER:CLR
  Bottom 0.152: L_REGISTER:IC2.15 32.07,27.62 51.75,27.62 L_REGISTER:IC1.15
N$1
  Top 0.152: E_REGISTER:IC2.15 29.53,58.1 29.53,70.17 | D_REGISTER:IC2.15 29.53,70.17 | C_REGISTER:IC2.15 29.53,84.14 29.53,70.17 | U$1.RST1 U$1.RST | E_REGISTER:IC1.15 52.39,58.1 52.39,70.17 | D_REGISTER:IC1.15 52.39,70.17 | C_REGISTER:IC1.15 52.39,84.14 52.39,70.17
  Bottom 0.152: E_REGISTER:IC1.15 54.93,55.56 | E_REGISTER:IC2.15 32.07,55.56 54.93,55.56 | 54.93,55.56 90.11,55.56 97,48.67 97,7.99 93.33,4.32 88.39,4.32 U$1.RST1
N$18  (via drill 0.35)
  Top 0.152: IC1.2 42.23,14.29 42.23,26.04 44.13,27.94 44.13,45.08 43.18,46.04 43.18,47.62 | H_REGISTER:IC1.6 43.18,47.62 | 43.18,47.62 v44.13,47.62
  Bottom 0.152: H_REGISTER:IC3.2 79.69,52.39 78.11,52.39 77.15,51.43 77.15,47.62 v44.13,47.62
N$19  (via drill 0.35)
  Top 0.152: IC1.3 43.18,18.1 44.45,19.37 v44.45,45.72 | H_REGISTER:IC1.5 v45.72,46.99
  Bottom 0.152: v44.45,45.72 v45.72,46.99 78.74,46.99 H_REGISTER:IC3.3
N$20  (via drill 0.35)
  Top 0.152: IC1.4 45.72,18.1 46.99,19.37 46.99,25.72 49.21,27.94 v49.21,48.26 49.21,49.85 H_REGISTER:IC1.4
  Bottom 0.152: H_REGISTER:IC3.4 76.2,48.26 v49.21,48.26
N$21  (via drill 0.35)
  Top 0.152: v54.29,18.73 54.29,52.07 53.98,52.39 | 53.98,52.39 52.39,53.97 50.8,53.97 H_REGISTER:IC1.3 | 53.98,52.39 v55.88,54.29
  Bottom 0.152: v54.29,18.73 IC1.5 | H_REGISTER:IC3.5 70.17,54.29 v55.88,54.29
N$22  (via drill 0.35)
  Top 0.152: v69.85,14.61 72.07,16.83 72.07,49.85 H_REGISTER:IC3.6
  Bottom 0.152: IC1.6 52.7,14.61 v69.85,14.61 | H_REGISTER:IC2.6 21.91,49.21 69.53,49.21 H_REGISTER:IC3.6
N$23  (via drill 0.35)
  Top 0.152: IC1.7 52.39,13.65 52.39,53.02 v52.07,53.34
  Bottom 0.152: H_REGISTER:IC2.5 25.72,53.66 52.07,53.66 | 52.07,53.66 65.72,53.66 H_REGISTER:IC3.7 | 52.07,53.66 v52.07,53.34
N$24  (via drill 0.35)
  Top 0.152: IC1.8 56.83,13.65 56.83,43.5 57.47,44.13 v57.47,53.02
  Bottom 0.152: H_REGISTER:IC2.4 27.31,52.7 57.47,52.7 | 57.47,52.7 64.13,52.7 H_REGISTER:IC3.8 | 57.47,52.7 v57.47,53.02
N$25
  Top 0.152: IC1.9 59.69,11.43 59.69,9.84 61.59,7.94 62.55,7.94 62.55,49.85 H_REGISTER:IC3.9
  Bottom 0.152: H_REGISTER:IC2.3 29.53,52.39 61.91,52.39 H_REGISTER:IC3.9
N$26  (via drill 0.35)
  Top 0.152: v42.55,34.61 43.18,35.24 L_REGISTER:IC1.6
  Bottom 0.152: v42.55,34.61 19.37,34.61 | L_REGISTER:IC3.2 78.74,39.37 20.64,39.37 19.37,38.1 19.37,34.61 | 19.37,34.61 18.29,34.61 8.97,25.29 8.97,16.43 IC2.2
N$27  (via drill 0.35)
  Top 0.152: v43.81,15.24 44.77,16.19 44.77,26.04 46.67,27.94 v46.67,33.34 46.67,35.88 L_REGISTER:IC1.5
  Bottom 0.152: IC2.3 16.83,11.11 34.29,11.11 38.42,15.24 v43.81,15.24 | L_REGISTER:IC3.3 75.25,33.34 v46.67,33.34
N$28  (via drill 0.35)
  Top 0.152: v48.26,33.97 L_REGISTER:IC1.4
  Bottom 0.152: IC2.4 13.02,17.46 11.1,17.46 9.27,19.29 9.27,25.16 18.09,33.97 v48.26,33.97 73.34,33.97 L_REGISTER:IC3.4
N$29  (via drill 0.35)
  Top 0.152: v46.36,15.88 47.31,16.83 47.31,23.5 51.75,27.94 v51.75,34.61 51.75,35.88 L_REGISTER:IC1.3
  Bottom 0.152: IC2.5 23.5,15.88 v46.36,15.88 | L_REGISTER:IC3.5 71.44,34.61 v51.75,34.61
N$30
  Top 0.152: IC2.6 21.91,13.65 21.91,34.92 20.32,36.51 L_REGISTER:IC2.6
  Bottom 0.152: L_REGISTER:IC3.6 69.53,35.24 21.91,35.24 L_REGISTER:IC2.6
N$31
  Top 0.152: L_REGISTER:IC2.5 24.13,35.56 24.13,13.97 IC2.7
  Bottom 0.152: L_REGISTER:IC3.7 66.36,39.05 25.08,39.05 L_REGISTER:IC2.5
N$32
  Top 0.152: L_REGISTER:IC2.4 26.67,35.56 26.67,17.46 27.94,16.19 IC2.8
  Bottom 0.152: L_REGISTER:IC3.8 64.13,38.73 27.31,38.73 L_REGISTER:IC2.4
N$33
  Top 0.152: L_REGISTER:IC2.3 29.53,35.24 29.53,13.65 IC2.9
  Bottom 0.152: L_REGISTER:IC3.9 61.91,38.42 29.53,38.42 L_REGISTER:IC2.3
VCC
  Top 0.152: IC2.20 IC2.1 | IC1.1 IC1.20 38.1,24.13 33.97,28.26 | 33.97,28.26 L_REGISTER:IC2.16 | 33.97,42.23 H_REGISTER:IC2.16 | 33.97,28.26 33.97,42.23 | 33.97,56.2 E_REGISTER:IC2.16 | 33.97,42.23 33.97,56.2 | 33.97,70.17 D_REGISTER:IC2.16 | 33.97,56.2 33.97,70.17 | C_REGISTER:IC2.16 33.97,84.14 33.97,70.17 | L_REGISTER:IC1.16 54.93,30.16 54.93,42.23 H_REGISTER:IC1.16 56.83,44.13 56.83,56.2 E_REGISTER:IC1.16 54.93,58.1 54.93,70.17 | D_REGISTER:IC1.16 54.93,70.17 | C_REGISTER:IC1.16 54.93,84.14 54.93,70.17 | C_REGISTER:IC3.1 C_REGISTER:IC3.20 D_REGISTER:IC3.1 D_REGISTER:IC3.20 E_REGISTER:IC3.1 E_REGISTER:IC3.20 H_REGISTER:IC3.1 H_REGISTER:IC3.20 L_REGISTER:IC3.1 L_REGISTER:IC3.20 83.82,11.43 U$1.VCC1 U$1.VCC
  Bottom 0.152: IC2.20 12.7,17.78 35.56,17.78 IC1.20 | H_REGISTER:IC1.16 59.37,46.67 79.69,46.67 H_REGISTER:IC3.1 | C_REGISTER:IC3.20 81.97,83.24 34.87,83.24 C_REGISTER:IC2.16